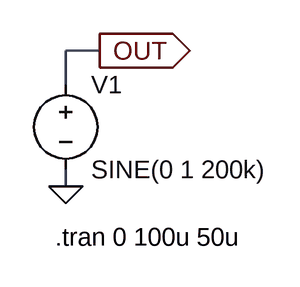
[diagram p0: schematic SineWave.asc]
SineWave.asc, the LTspice schematic file:
Version 4
SHEET 1 880 680
WIRE 192 96 160 96
WIRE 160 128 160 96
WIRE 160 224 160 208
FLAG 160 224 0
FLAG 192 96 OUT
IOPIN 192 96 Out
SYMBOL voltage 160 112 R0
WINDOW 123 0 0 Left 2
WINDOW 39 0 0 Left 2
SYMATTR InstName V1
SYMATTR Value SINE(0 1 200k)
TEXT 150 272 Left 2 !.tran 0 100u 50u

The netlist it stands for:
* SineWave.asc
V1 OUT 0 SINE(0 1 200k)
.tran 0 100u 50u
.backanno
.end